# Altium project femtoino.PrjPcb (part 1 of 2)
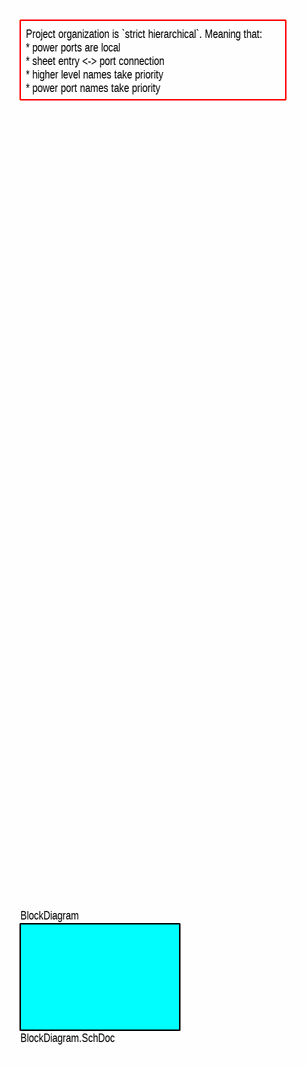
[diagram p0: TitlePage.SchDoc]
GlobalProjectName: femtoino; GlobalRevision: rev.1
11 sheets, 82 parts. Net scope: strictly hierarchical (ports join the sheet entries above them; power ports are local).
Board file: PCB.PcbDoc
Sheets:
  TitlePage.SchDoc
    BlockDiagram = BlockDiagram.SchDoc
      PowerManagement = PowerManagement.SchDoc
        Buck/Boost converter = Buck_boost_converter.SchDoc
        Li-ion charger = Li-ion_charger.SchDoc
      MCU = MCU.SchDoc
      DAC = DAC.SchDoc
      External connectors = External_connectors.SchDoc
        USB = USB.SchDoc
      LED = LED.SchDoc
      Buzzer = Buzzer.SchDoc

## Sheet TitlePage.SchDoc: Title page.
size 297 x 209 mm; Author: Dmitry Shpakov; Organization: NoName; Revision: Revision; SheetNumber: 1; SheetTotal: 9; PageSize: A4; ProjectName: Project Name

### Sub-sheets
BlockDiagram = BlockDiagram.SchDoc: no entries

### Notes on the sheet
- Project organization is `strict hierarchical`. Meaning that:
  * power ports are local
  * sheet entry <-> port connection
  * higher level names take priority
  * power port names take priority
- Author
- Date
- Organization
- Page
- Total pages
- Materials
- Page size

## Sheet BlockDiagram.SchDoc: Block diagram.
size 297 x 209 mm; Author: Dmitry Shpakov; Organization: NoName; Revision: Revision; SheetNumber: 2; SheetTotal: 11; PageSize: A4; ProjectName: Project Name
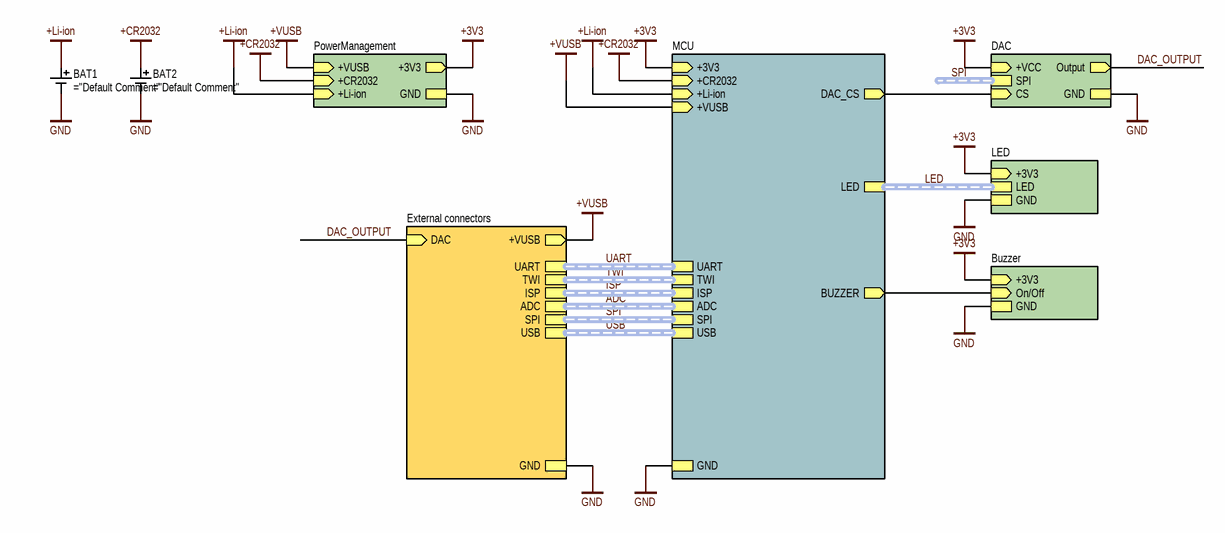
[diagram p1: BlockDiagram.SchDoc]

### Parts
BAT1  (no value)
BAT2  (no value)

### Sub-sheets
Buzzer = Buzzer.SchDoc: +3V3 (in), On/Off (in), GND
DAC = DAC.SchDoc: SPI (harness SPI), GND, CS (in), +VCC (in), Output (out)
External connectors = External_connectors.SchDoc: UART (harness UART), TWI (harness TWI), ISP (harness ISP), ADC (harness ADC), SPI (harness SPI), DAC (in), GND, USB (harness USB), +VUSB (out)
LED = LED.SchDoc: GND, LED (harness LED), +3V3 (in)
MCU = MCU.SchDoc: USB (harness USB), GND, +3V3 (in), SPI (harness SPI), DAC_CS (out), UART (harness UART), TWI (harness TWI), ISP (harness ISP), ADC (harness ADC), LED (harness LED), +VUSB (in), +Li-ion (in), +CR2032 (in), BUZZER (out)
PowerManagement = PowerManagement.SchDoc: +3V3 (out), GND, +VUSB (in), +CR2032 (in), +Li-ion (in)

### Nets
+3V3: sheet PowerManagement/+3V3, sheet MCU/+3V3, sheet DAC/+VCC, sheet LED/+3V3, sheet Buzzer/+3V3
+CR2032: BAT2.POS ; sheet PowerManagement/+CR2032, sheet MCU/+CR2032
+Li-ion: BAT1.POS ; sheet PowerManagement/+Li-ion, sheet MCU/+Li-ion
+VUSB: sheet PowerManagement/+VUSB, sheet MCU/+VUSB, sheet External connectors/+VUSB
GND: BAT1.NEG BAT2.NEG ; sheet PowerManagement/GND, sheet MCU/GND, sheet DAC/GND, sheet External connectors/GND, sheet LED/GND, sheet Buzzer/GND
BUZZER: sheet MCU/BUZZER, sheet Buzzer/On/Off
DAC_CS: sheet MCU/DAC_CS, sheet DAC/CS
DAC_OUTPUT: sheet DAC/Output, sheet External connectors/DAC

### Buses and harness runs
harness ADC = sheet External connectors/ADC = sheet MCU/ADC
harness ISP = sheet External connectors/ISP = sheet MCU/ISP
harness LED = sheet LED/LED = sheet MCU/LED
harness SPI = sheet DAC/SPI
harness SPI = sheet External connectors/SPI = sheet MCU/SPI
harness TWI = sheet External connectors/TWI = sheet MCU/TWI
harness UART = sheet External connectors/UART = sheet MCU/UART
harness USB = sheet External connectors/USB = sheet MCU/USB

### Notes on the sheet
- Author
- Date
- Organization
- Page
- Total pages
- Materials
- Page size

### Library data of the parts
BAT1 = S2B-PH-K-S(LF)(SN): CONN HEADER R/A 2POS 2MM; Manufacturer: JST Sales America Inc.; Default Comment: JST-PH-2; Power Dissipation: * W; Rated Voltage: * V; Rated Current: * A; Tolerance: * %; Other: Connector Header Through Hole, Right Angle 2 position 0.079" (2.00mm); Operating Temperature: -25 °C to +85 °C; Type: connector; HelpURL: https://www.digikey.com/en/products/detail/jst-sales-america-inc/S2B-PH-K-S-LF-SN/926626; Rated Power: * W; Value: *; Summary: ="Type"+" "+"Part Number"+" "+"Manufacturer"+" "+"Value"+" "+"Tolerance"+" "+"Operating Temperature"+" "+"Case"+" "+"Power Dissipation"+" "+"Rated Current"+" "+"Rated Power"+" "+"Rated Voltage"+" "+"Other"; Assembly: *; Case: JST-PH-2; Part Number: S2B-PH-K-S(LF)(SN)
BAT2 = BU2032SM-HD-G: BATT HOLDER COIN 20MM 1 CELL SMD; Manufacturer: MPD (Memory Protection Devices); Default Comment: CR2032; Power Dissipation: * W; Rated Voltage: * V; Rated Current: * A; Tolerance: * %; Other: Battery Holder (Open) Coin, 20.0mm 1 Cell SMD (SMT) Tab; Operating Temperature: -40 °C to +280 °C; Type: connector; HelpURL: https://www.digikey.com/en/products/detail/mpd-memory-protection-devices/BU2032SM-HD-G/755446; Rated Power: * W; Value: *; Summary: ="Type"+" "+"Part Number"+" "+"Manufacturer"+" "+"Value"+" "+"Tolerance"+" "+"Operating Temperature"+" "+"Case"+" "+"Power Dissipation"+" "+"Rated Current"+" "+"Rated Power"+" "+"Rated Voltage"+" "+"Other"; Assembly: *; Case: CR2032; Part Number: BU2032SM-HD-G

## Sheet PowerManagement.SchDoc: Power management.
size 297 x 209 mm; Author: Dmitry Shpakov; Organization: NoName; Revision: Revision; SheetNumber: 3; SheetTotal: 10; PageSize: A4; ProjectName: Project Name
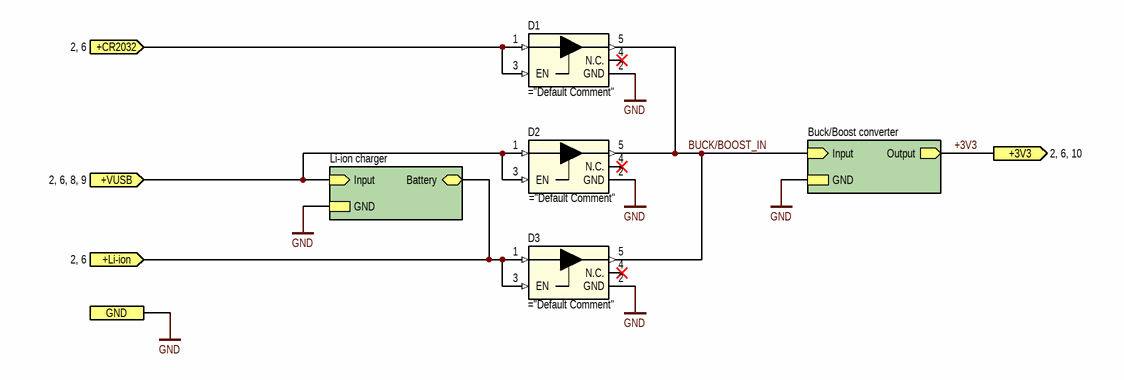
[diagram p2: PowerManagement.SchDoc]

### Parts
D1  (no value)
D2  (no value)
D3  (no value)

### Sub-sheets
Buck/Boost converter = Buck_boost_converter.SchDoc: Input (in), Output (out), GND
Li-ion charger = Li-ion_charger.SchDoc: Input (in), Battery (bidir), GND

### Ports
+3V3 (out, see 2, 6, 10), +CR2032 (in, see 2, 6), +Li-ion (in, see 2, 6), +VUSB (in, see 2, 6, 8, 9), GND (see 2, 4, 5, 6, 7, 8, 9, 10)

### Nets
+3V3: port +3V3, sheet Buck/Boost converter/Output
+CR2032: D1.1(VDD) D1.3(EN) ; port +CR2032
+Li-ion: D3.1(VDD) D3.3(EN) ; port +Li-ion, sheet Li-ion charger/Battery
+VUSB: D2.1(VDD) D2.3(EN) ; port +VUSB, sheet Li-ion charger/Input
GND: D1.2(GND) D2.2(GND) D3.2(GND) ; port GND, sheet Buck/Boost converter/GND, sheet Li-ion charger/GND
BUCK/BOOST_IN: D1.5(OUT) D2.5(OUT) D3.5(OUT) ; sheet Buck/Boost converter/Input

Not connected (* = marked no-connect by the designer): D1 4(N.C.)*; D2 4(N.C.)*; D3 4(N.C.)*

### Notes on the sheet
- Author
- Date
- Organization
- Page
- Total pages
- Materials
- Page size

### Library data of the parts
D1-D3 = MAX40200: IC IDEAL DIODE; Manufacturer: Analog Devices Inc./Maxim Integrated; Default Comment: MAX40203AUK+T; Power Dissipation: * W; Rated Voltage: 1.2 V ~ 5.5 V; Rated Current: 1 A; Tolerance: * %; Other: OR Controller Source Selector Switch P-Channel 1:1 SOT-23-5; Operating Temperature: -40 °C to +125 °C; Type: diode; HelpURL: https://www.digikey.com/en/products/detail/analog-devices-inc-maxim-integrated/MAX40203AUK-T/10447227; Rated Power: * W; Value: *; Summary: ="Type"+" "+"Part Number"+" "+"Manufacturer"+" "+"Value"+" "+"Tolerance"+" "+"Operating Temperature"+" "+"Case"+" "+"Power Dissipation"+" "+"Rated Current"+" "+"Rated Power"+" "+"Rated Voltage"+" "+"Other"; Assembly: *; Case: SOT-23-5; Part Number: MAX40203AUK+T

## Sheet Buck_boost_converter.SchDoc: +3V3 buck/boost converter.
size 297 x 209 mm; Author: Dmitry Shpakov; Organization: NoName; Revision: Revision; SheetNumber: 4; SheetTotal: 5; PageSize: A4; ProjectName: Project Name
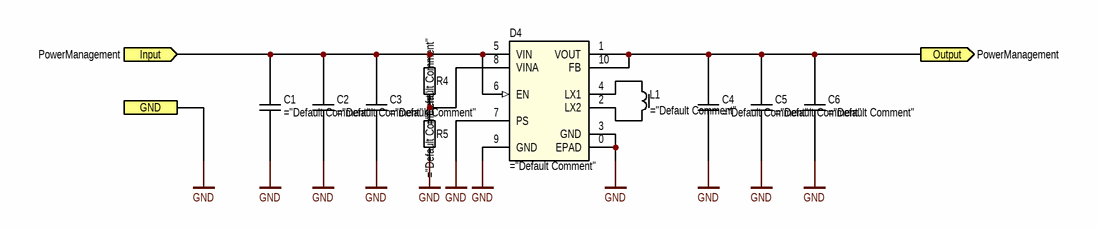
[diagram p3: Buck_boost_converter.SchDoc]

### Parts
C1  (no value)
C2  (no value)
C3  (no value)
C4  (no value)
C5  (no value)
C6  (no value)
D4  (no value)
L1  (no value)
R4  (no value)
R5  (no value)

### Ports
GND (see PowerManagement, Li-ion_charger, PowerManagement), Input (in, see PowerManagement), Output (out, see PowerManagement)

### Nets
+3V3: C4.1 C5.1 C6.2 D4.1(VOUT) D4.10(FB) ; port Output
GND: C1.1 C2.2 C3.2 C4.2 C5.2 C6.1 D4.0(EPAD) D4.3(GND) D4.7(PS) D4.9(GND) R5.1 ; port GND
BUCK/BOOST_IN: C1.2 C2.1 C3.1 D4.5(VIN) D4.6(EN) R4.2 ; port Input
NetD4_2: D4.2(LX2) L1.2
NetD4_4: D4.4(LX1) L1.1
NetD4_8: D4.8(VINA) R4.1 R5.2

### Notes on the sheet
- Author
- Date
- Organization
- Page
- Total pages
- Materials
- Page size

### Library data of the parts
C1 C6 = CC0805KKX5R6BB105: CAP CER 1UF 10V X5R 0805; Manufacturer: YAGEO; Type: capacitor; Power Dissipation: * W; Rated Current: * A; Tolerance: 10 %; Other: 1 µF ±10% 10V Ceramic Capacitor X5R 0805 (2012 Metric); Operating Temperature: -55 °C to +85 °C; HelpURL: https://www.digikey.com/en/products/detail/yageo/CC0805KKX5R6BB105/2345239; Default Comment: 1 uF; Rated Voltage: 10 V; Rated Power: * W; Value: 1 uF; Summary: ="Type"+" "+"Part Number"+" "+"Manufacturer"+" "+"Value"+" "+"Tolerance"+" "+"Operating Temperature"+" "+"Case"+" "+"Power Dissipation"+" "+"Rated Current"+" "+"Rated Power"+" "+"Rated Voltage"+" "+"Other"; Assembly: *; Case: 0805; Part Number: CC0805KKX5R6BB105
C2-C5 = CC0805KPX5R6BB106: CAP CER 10UF 10V X5R 0805; Manufacturer: YAGEO; Type: capacitor; Power Dissipation: * W; Rated Current: * A; Tolerance: 10 %; Other: 10 µF ±10% 10V Ceramic Capacitor X5R 0805 (2012 Metric); Operating Temperature: -55 °C to +85 °C; HelpURL: https://www.digikey.com/en/products/detail/yageo/CC0805KPX5R6BB106/11611309; Default Comment: 10 uF; Rated Voltage: 10 V; Rated Power: * W; Value: 10 uF; Summary: ="Type"+" "+"Part Number"+" "+"Manufacturer"+" "+"Value"+" "+"Tolerance"+" "+"Operating Temperature"+" "+"Case"+" "+"Power Dissipation"+" "+"Rated Current"+" "+"Rated Power"+" "+"Rated Voltage"+" "+"Other"; Assembly: *; Case: 0805; Part Number: CC0805KPX5R6BB106
D4 = RT6150B-33GQW: IC REG BCK BST 3.3V 800MA 10WDFN; Manufacturer: Richtek USA Inc.; Power Dissipation: * W; Tolerance: * %; Other: Buck-Boost Switching Regulator IC Positive Fixed 3.3V 1 Output 800mA 10-WFDFN Exposed Pad; Operating Temperature: -40 °C to +85 °C; Type: ic; HelpURL: https://www.digikey.com/en/products/detail/richtek-usa-inc/RT6150B-33GQW/6676709; Default Comment: RT6150B-33GQW; Rated Voltage: 3.3 V; Rated Current: 800 mA; Rated Power: * W; Value: *; Summary: ="Type"+" "+"Part Number"+" "+"Manufacturer"+" "+"Value"+" "+"Tolerance"+" "+"Operating Temperature"+" "+"Case"+" "+"Power Dissipation"+" "+"Rated Current"+" "+"Rated Power"+" "+"Rated Voltage"+" "+"Other"; Assembly: *; Case: 10-WDFN (2.5x2.5); Part Number: RT6150B-33GQW
L1 = 74479887222C: FIXED IND 2.2UH 1.6A 110MOHM SMD; Manufacturer: Würth Elektronik; Type: inductor; Power Dissipation: * W; Rated Voltage: * V; Tolerance: * %; Other: 2.2 µH Shielded Multilayer Inductor 1.6 A 110mOhm 1008 (2520 Metric); Operating Temperature: -40 °C to +125 °C; HelpURL: https://www.digikey.com/en/products/detail/w%C3%BCrth-elektronik/74479887222C/5870496; Default Comment: 2.2 uH; Rated Current: 1.6 A; Rated Power: * W; Value: 2.2 uH; Summary: ="Type"+" "+"Part Number"+" "+"Manufacturer"+" "+"Value"+" "+"Tolerance"+" "+"Operating Temperature"+" "+"Case"+" "+"Power Dissipation"+" "+"Rated Current"+" "+"Rated Power"+" "+"Rated Voltage"+" "+"Other"; Assembly: *; Case: 1008; Part Number: 74479887222C
R4 = RC0603FR-0756KL: RES 56K OHM 1% 1/10W 0603; Manufacturer: YAGEO; Rated Voltage: * V; Rated Current: * A; Other: 56 kOhms ±1% 0.1W, 1/10W Chip Resistor 0603 (1608 Metric) Moisture Resistant Thick Film; Operating Temperature: -55 °C to +155 °C; Type: resistor; HelpURL: https://www.digikey.com/en/products/detail/yageo/RC0603FR-0756KL/2827626; Default Comment: 56k; Power Dissipation: 1/10 W; Rated Power: 1/10 W; Tolerance: 1 %; Value: 56k; Summary: ="Type"+" "+"Part Number"+" "+"Manufacturer"+" "+"Value"+" "+"Tolerance"+" "+"Operating Temperature"+" "+"Case"+" "+"Power Dissipation"+" "+"Rated Current"+" "+"Rated Power"+" "+"Rated Voltage"+" "+"Other"; Assembly: *; Case: 0603; Part Number: RC0603FR-0756KL
R5 = RC0603FR-0786K6L: RES 86.6K OHM 1% 1/10W 0603; Manufacturer: YAGEO; Default Comment: 86k6; Rated Voltage: * V; Rated Current: * A; Value: 86k6; Other: 86.6 kOhms ±1% 0.1W, 1/10W Chip Resistor 0603 (1608 Metric) Moisture Resistant Thick Film; Operating Temperature: -55 °C to +155 °C; Type: resistor; HelpURL: https://www.digikey.com/en/products/detail/yageo/RC0603FR-0786K6L/727411?s=N4IgjCBcoMxaBjKAzAhgGwM4FMA0IB7KAbXDBggF18AHAFyhAGU6AnASwDsBzEAX3xgAbPBBJIaLHkIkQMAJwAmACwjqIeoxYce-fIoAMADgCso8ZJz4ikUkaEA6IQAIA1gHkAFgFtMIdZqQIACqnOx07sgAstiomACurNh6IAC0ENBiKBhWMrbgcJQCaYrmUGzx0jakZkXFIpnsACaM6QaltAxBIPh0AJ40yUFNmEh8fEA; Power Dissipation: 1/10 W; Rated Power: 1/10 W; Tolerance: 1 %; Summary: ="Type"+" "+"Part Number"+" "+"Manufacturer"+" "+"Value"+" "+"Tolerance"+" "+"Operating Temperature"+" "+"Case"+" "+"Power Dissipation"+" "+"Rated Current"+" "+"Rated Power"+" "+"Rated Voltage"+" "+"Other"; Assembly: *; Case: 0603; Part Number: RC0603FR-0786K6L

## Sheet Li-ion_charger.SchDoc: Li-ion battery charger.
size 297 x 209 mm; Author: Dmitry Shpakov; Organization: NoName; Revision: Revision; SheetNumber: 5; SheetTotal: 5; PageSize: A4; ProjectName: Project Name
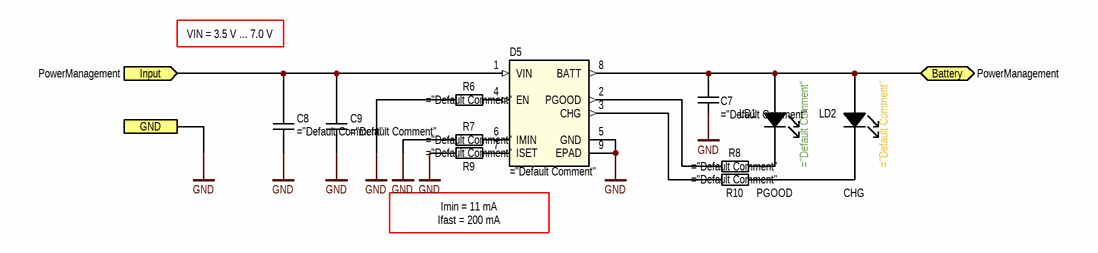
[diagram p4: Li-ion_charger.SchDoc]

### Parts
C7  (no value)
C8  (no value)
C9  (no value)
D5  (no value)
LD1  (no value)
LD2  (no value)
R6  (no value)
R7  (no value)
R8  (no value)
R9  (no value)
R10  (no value)

### Ports
Battery (bidir, see PowerManagement), GND (see PowerManagement, Buck_boost_converter, PowerManagement), Input (in, see PowerManagement)

### Nets
+Li-ion: C7.2 D5.8(BATT) LD1.C LD2.C ; port Battery
+VUSB: C8.1 C9.2 D5.1(VIN) ; port Input
GND: C7.1 C8.2 C9.1 D5.5(GND) D5.9(EPAD) R6.1 R7.2 R9.1 ; port GND
NetD5_2: D5.2(PGOOD) R8.1
NetD5_3: D5.3(CHG) R10.1
NetD5_4: D5.4(EN) R6.2
NetD5_6: D5.6(IMIN) R7.1
NetD5_7: D5.7(ISET) R9.2
NetLD1_A: LD1.A R8.2
NetLD2_A: LD2.A R10.2

### Notes on the sheet
- VIN = 3.5 V ... 7.0 V
- Imin = 11 mA
  Ifast = 200 mA
- PGOOD
- CHG
- Author
- Date
- Organization
- Page
- Total pages
- Materials
- Page size

### Library data of the parts
C7 C9 = CC0805KKX5R6BB105: as C1 on sheet Buck_boost_converter; Operating Temperature: -55 °C to +85 °C; HelpURL: https://www.digikey.com/en/products/detail/yageo/CC0805KKX5R6BB105/2345239; Default Comment: 1 uF; Rated Voltage: 10 V; Rated Power: * W; Value: 1 uF; Summary: ="Type"+" "+"Part Number"+" "+"Manufacturer"+" "+"Value"+" "+"Tolerance"+" "+"Operating Temperature"+" "+"Case"+" "+"Power Dissipation"+" "+"Rated Current"+" "+"Rated Power"+" "+"Rated Voltage"+" "+"Other"; Assembly: *; Case: 0805; Part Number: CC0805KKX5R6BB105
C8 = CC0805KPX5R6BB106: as C2 on sheet Buck_boost_converter; Operating Temperature: -55 °C to +85 °C; HelpURL: https://www.digikey.com/en/products/detail/yageo/CC0805KPX5R6BB106/11611309; Default Comment: 10 uF; Rated Voltage: 10 V; Rated Power: * W; Value: 10 uF; Summary: ="Type"+" "+"Part Number"+" "+"Manufacturer"+" "+"Value"+" "+"Tolerance"+" "+"Operating Temperature"+" "+"Case"+" "+"Power Dissipation"+" "+"Rated Current"+" "+"Rated Power"+" "+"Rated Voltage"+" "+"Other"; Assembly: *; Case: 0805; Part Number: CC0805KPX5R6BB106
D5 = RT9526AGQW: IC LI-ION BATT CHGR WDFN-8; Manufacturer: Richtek USA Inc.; Power Dissipation: * W; Rated Voltage: 28 V; Rated Current: * A; Tolerance: * %; Other: Charger IC Lithium Ion 8-WDFN (2x3); Operating Temperature: -40 °C to +85 °C; Type: ic; HelpURL: https://www.digikey.com/en/products/detail/richtek-usa-inc/RT9526AGQW/16376728; Default Comment: RT9526AGQW; Rated Power: * W; Value: *; Summary: ="Type"+" "+"Part Number"+" "+"Manufacturer"+" "+"Value"+" "+"Tolerance"+" "+"Operating Temperature"+" "+"Case"+" "+"Power Dissipation"+" "+"Rated Current"+" "+"Rated Power"+" "+"Rated Voltage"+" "+"Other"; Assembly: *; Case: 8-WDFN (2x3); Part Number: RT9526AGQW
LD1 = LTST-C191KGKT: LED GREEN CLEAR SMD; Manufacturer: Lite-On Inc.; Power Dissipation: * W; Tolerance: * %; Other: Green 571nm LED Indication - Discrete 2V 0603 (1608 Metric); Rated Voltage: 2 V; Rated Current: 20 mA; Operating Temperature: -55 °C to +85 °C; Type: led; HelpURL: https://www.digikey.com/en/products/detail/liteon/LTST-C191KGKT/386835; Default Comment: green; Rated Power: * W; Summary: ="Type"+" "+"Part Number"+" "+"Manufacturer"+" "+"Value"+" "+"Tolerance"+" "+"Operating Temperature"+" "+"Case"+" "+"Power Dissipation"+" "+"Rated Current"+" "+"Rated Power"+" "+"Rated Voltage"+" "+"Other"; Assembly: *; Case: 0603; Part Number: LTST-C191KGKT; Value: green
LD2 = LTST-C191KSKT: LED YELLOW CLEAR SMD; Manufacturer: Lite-On Inc.; Power Dissipation: * W; Tolerance: * %; Other: Yellow 591nm LED Indication - Discrete 2.1V 0603 (1608 Metric); Rated Voltage: 2.1 V; Rated Current: 20 mA; Operating Temperature: -55 °C to +85 °C; Type: led; HelpURL: https://www.digikey.com/en/products/detail/liteon/LTST-C191KSKT/386839; Default Comment: yellow; Rated Power: * W; Summary: ="Type"+" "+"Part Number"+" "+"Manufacturer"+" "+"Value"+" "+"Tolerance"+" "+"Operating Temperature"+" "+"Case"+" "+"Power Dissipation"+" "+"Rated Current"+" "+"Rated Power"+" "+"Rated Voltage"+" "+"Other"; Assembly: *; Case: 0603; Part Number: LTST-C191KSKT; Value: yellow
R6 = RC0603FR-07200KL: RES 200K OHM 1% 1/10W 0603; Manufacturer: YAGEO; Power Dissipation: 0.1 W; Rated Voltage: * V; Rated Current: * A; Other: 200 kOhms ±1% 0.1W, 1/10W Chip Resistor 0603 (1608 Metric) Moisture Resistant Thick Film; Operating Temperature: -55 °C to +155 °C; Type: resistor; HelpURL: https://www.digikey.com/en/products/detail/yageo/RC0603FR-07200KL/727044; Default Comment: 200k; Rated Power: 0.1 W; Tolerance: 1 %; Value: 200k; Summary: ="Type"+" "+"Part Number"+" "+"Manufacturer"+" "+"Value"+" "+"Tolerance"+" "+"Operating Temperature"+" "+"Case"+" "+"Power Dissipation"+" "+"Rated Current"+" "+"Rated Power"+" "+"Rated Voltage"+" "+"Other"; Assembly: *; Case: 0603; Part Number: RC0603FR-07200KL
R7 = RC0603FR-071ML: RES 1M OHM 1% 1/10W 0603; Manufacturer: YAGEO; Power Dissipation: 0.1 W; Rated Voltage: * V; Rated Current: * A; Other: 1 MOhms ±1% 0.1W, 1/10W Chip Resistor 0603 (1608 Metric) Moisture Resistant Thick Film; Operating Temperature: -55 °C to +155 °C; Type: resistor; HelpURL: https://www.digikey.com/en/products/detail/yageo/RC0603FR-071ML/726844; Default Comment: 1M; Rated Power: 0.1 W; Tolerance: 1 %; Value: 1M; Summary: ="Type"+" "+"Part Number"+" "+"Manufacturer"+" "+"Value"+" "+"Tolerance"+" "+"Operating Temperature"+" "+"Case"+" "+"Power Dissipation"+" "+"Rated Current"+" "+"Rated Power"+" "+"Rated Voltage"+" "+"Other"; Assembly: *; Case: 0603; Part Number: RC0603FR-071ML
R8 R10 = RC0603FR-07270RL: RES 270 OHM 1% 1/10W 0603; Manufacturer: YAGEO; Default Comment: 270R; Power Dissipation: 0.1 W; Rated Voltage: * V; Rated Current: * A; Value: 270R; Other: 270 Ohms ±1% 0.1W, 1/10W Chip Resistor 0603 (1608 Metric) Moisture Resistant Thick Film; Operating Temperature: -55 °C to +155 °C; Type: resistor; HelpURL: https://www.digikey.com/en/products/detail/yageo/RC0603FR-07270RL/727103; Rated Power: 0.1 W; Tolerance: 1 %; Summary: ="Type"+" "+"Part Number"+" "+"Manufacturer"+" "+"Value"+" "+"Tolerance"+" "+"Operating Temperature"+" "+"Case"+" "+"Power Dissipation"+" "+"Rated Current"+" "+"Rated Power"+" "+"Rated Voltage"+" "+"Other"; Assembly: *; Case: 0603; Part Number: RC0603FR-07270RL
R9 = RC0603FR-0762KL: RES 62K OHM 1% 1/10W 0603; Manufacturer: YAGEO; Power Dissipation: 0.1 W; Rated Voltage: * V; Rated Current: * A; Other: 62 kOhms ±1% 0.1W, 1/10W Chip Resistor 0603 (1608 Metric) Moisture Resistant Thick Film; Operating Temperature: -55 °C to +155 °C; Type: resistor; HelpURL: https://www.digikey.com/en/products/detail/yageo/RC0603FR-0762KL/727336; Default Comment: 62k; Rated Power: 0.1 W; Tolerance: 1 %; Value: 62k; Summary: ="Type"+" "+"Part Number"+" "+"Manufacturer"+" "+"Value"+" "+"Tolerance"+" "+"Operating Temperature"+" "+"Case"+" "+"Power Dissipation"+" "+"Rated Current"+" "+"Rated Power"+" "+"Rated Voltage"+" "+"Other"; Assembly: *; Case: 0603; Part Number: RC0603FR-0762KL

## Sheet MCU.SchDoc: MCU
size 297 x 209 mm; Author: Dmitry Shpakov; Organization: NoName; Revision: Revision; SheetNumber: 6; SheetTotal: 10; PageSize: A4; ProjectName: Project Name
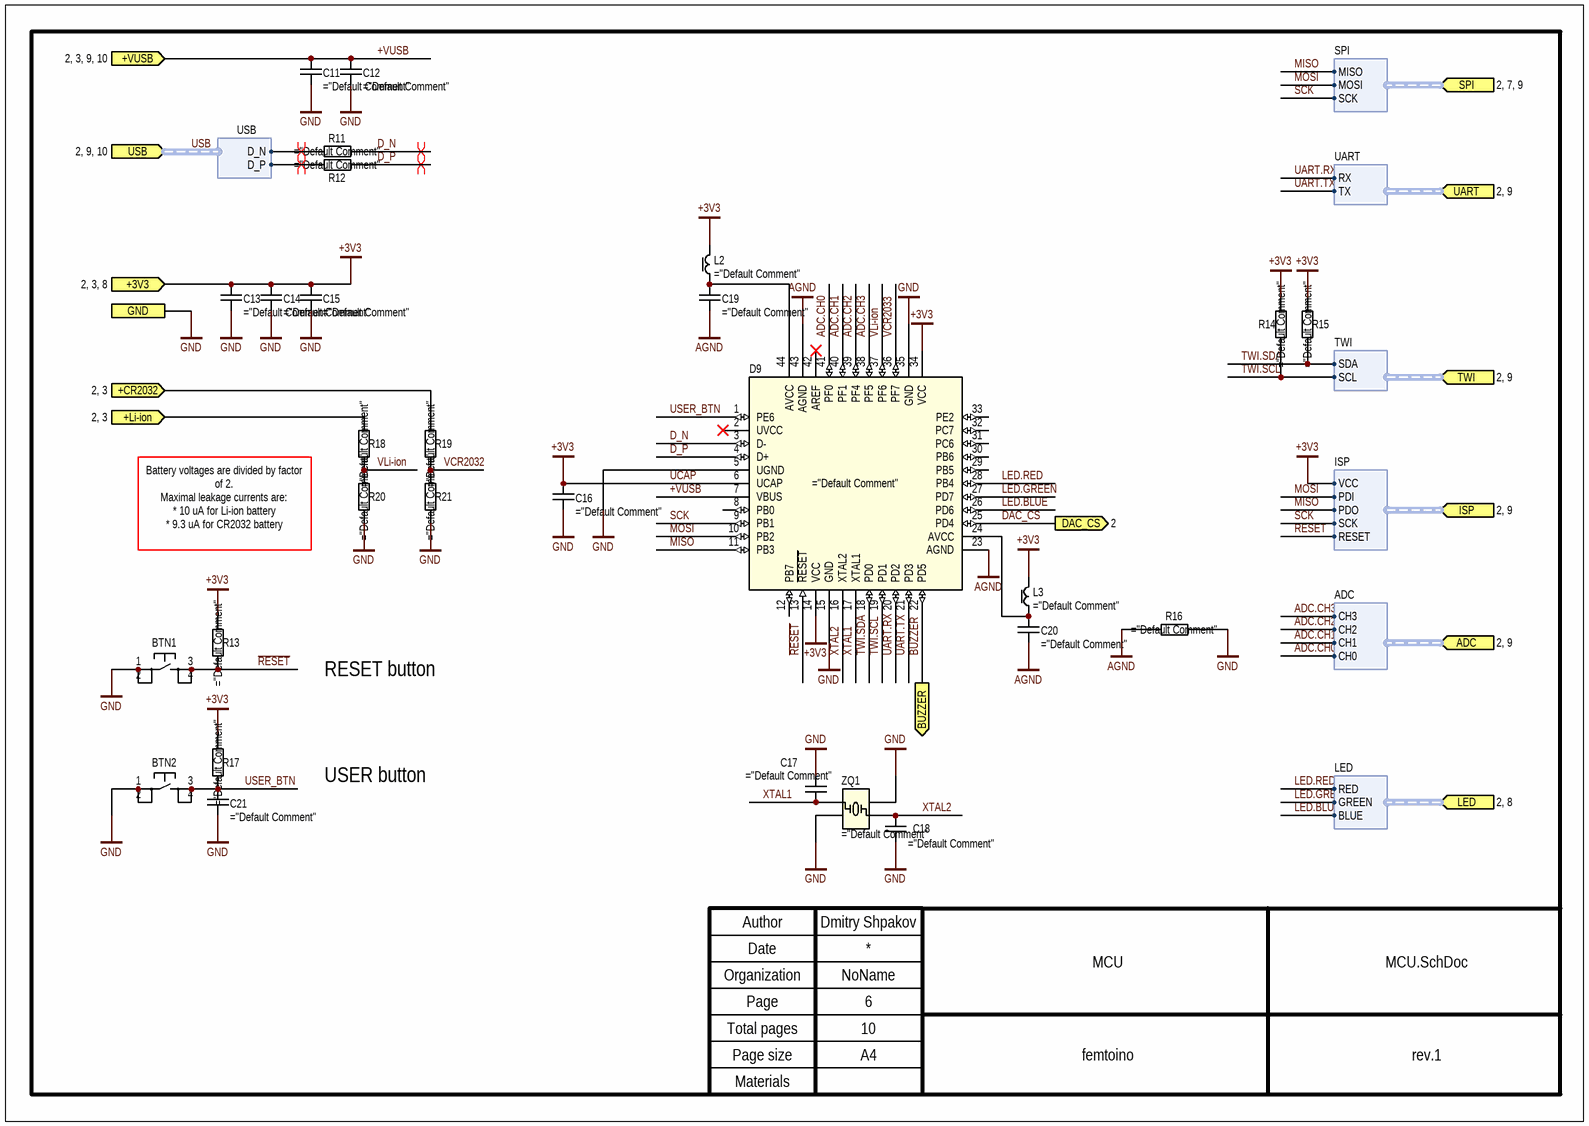
[diagram p5: MCU.SchDoc]

### Parts
BTN1  (no value)
BTN2  (no value)
C11  (no value)
C12  (no value)
C13  (no value)
C14  (no value)
C15  (no value)
C16  (no value)
C17  (no value)
C18  (no value)
C19  (no value)
C20  (no value)
C21  (no value)
D9  (no value)
L2  (no value)
L3  (no value)
R11  (no value)
R12  (no value)
R13  (no value)
R14  (no value)
R15  (no value)
R16  (no value)
R17  (no value)
R18  (no value)
R19  (no value)
R20  (no value)
R21  (no value)
ZQ1  (no value)

### Ports
+3V3 (in, see 2, 3, 8), +CR2032 (in, see 2, 3), +Li-ion (in, see 2, 3), +VUSB (in, see 2, 3, 9, 10), ADC (in, harness ADC, see 2, 9), BUZZER (out), DAC_CS (out, see 2), GND (see 2, 3, 4, 5, 7, 8, 9, 10), ISP (in, harness ISP, see 2, 9), LED (in, harness LED, see 2, 8), SPI (in, harness SPI, see 2, 7, 9), TWI (in, harness TWI, see 2, 9), UART (in, harness UART, see 2, 9), USB (in, harness USB, see 2, 9, 10)

### Harnesses
USB: D_N, D_P
SPI: MISO, MOSI, SCK
UART: RX, TX
TWI: SDA, SCL
ISP: VCC, PDI, PDO, SCK, RESET
ADC: CH3, CH2, CH1, CH0
LED: RED, GREEN, BLUE

### Nets
+3V3: C13.2 C14.2 C15.2 C16.2 D9.6(UCAP) D9.14(VCC) D9.34(VCC) L2.2 L3.2 R13.2 R14.2 R15.2 R17.2 ; port +3V3, port ISP.VCC  [also labelled UCAP]
+CR2032: R19.2 ; port +CR2032
+Li-ion: R18.2 ; port +Li-ion
+VUSB: C11.2 C12.2 D9.7(VBUS) ; port +VUSB
AGND: C19.1 C20.1 D9.23(AGND) D9.43(AGND) R16.1
GND: BTN1.1 BTN1.2 BTN2.1 BTN2.2 C11.1 C12.1 C13.1 C14.1 C15.1 C16.1 C17.1 C18.1 C21.1 D9.5(UGND) D9.15(GND) D9.35(GND) R16.2 R20.1 R21.1 ZQ1.2 ZQ1.4 ; port GND
ADC.CH0: D9.41(PF0) ; port ADC.CH0
ADC.CH1: D9.40(PF1) ; port ADC.CH1
ADC.CH2: D9.39(PF4) ; port ADC.CH2
ADC.CH3: D9.38(PF5) ; port ADC.CH3
BUZZER: D9.22(PD5) ; port BUZZER
D_N: D9.3(D-) R11.2
D_P: D9.4(D+) R12.2
DAC_CS: D9.25(PD4) ; port DAC_CS
LED.BLUE: D9.26(PD6) ; port LED.BLUE
LED.GREEN: D9.27(PD7) ; port LED.GREEN
LED.RED: D9.28(PB4) ; port LED.RED
MISO: D9.11(PB3) ; port SPI.MISO, port ISP.PDO  [project net ISP.PDO]
MOSI: D9.10(PB2) ; port SPI.MOSI, port ISP.PDI  [project net ISP.PDI]
~{RESET}: BTN1.3 BTN1.4 D9.13(~{RESET}) R13.1 ; port ISP.RESET  [project net ISP.RESET]
SCK: D9.9(PB1) ; port SPI.SCK, port ISP.SCK  [project net ISP.SCK]
TWI.SCL: D9.19(PD1) R14.1 ; port TWI.SCL
TWI.SDA: D9.18(PD0) R15.1 ; port TWI.SDA
UART.RX: D9.20(PD2) ; port UART.RX
UART.TX: D9.21(PD3) ; port UART.TX
USB.D_N: R11.1 ; port USB.D_N
USB.D_P: R12.1 ; port USB.D_P
USER_BTN: BTN2.3 BTN2.4 C21.2 D9.1(PE6) R17.1
VCR2032: R19.1 R21.2
VCR2033: D9.36(PF7)
VLi-ion: D9.37(PF6) R18.1 R20.2
XTAL1: C17.2 D9.17(XTAL1) ZQ1.1
XTAL2: C18.2 D9.16(XTAL2) ZQ1.3
NetC19_2: C19.2 D9.44(AVCC) L2.1
NetC20_2: C20.2 D9.24(AVCC) L3.1

Not connected (* = marked no-connect by the designer): D9 2(UVCC)* 8(PB0) 12(PB7) 29(PB5) 30(PB6) 31(PC6) 32(PC7) 33(PE2) 42(AREF)*

### Buses and harness runs
harness USB = port USB

### Layout directives
differential pair: D_N, D_P, USB.D_N, USB.D_P

### Notes on the sheet
- Battery voltages are divided by factor of 2.
  Maximal leakage currents are:
  * 10 uA for Li-ion battery
  * 9.3 uA for CR2032 battery
- RESET button
- USER button
- Author
- Date
- Organization
- Page
- Total pages
- Materials
- Page size

### Library data of the parts
BTN1 BTN2 = PTS810 SJK 250 SMTR LFS: SWITCH TACTILE SPST-NO 0.05A 16V; Manufacturer: C&K; Power Dissipation: * W; Rated Voltage: * V; Rated Current: * A; Tolerance: * %; Other: Tactile Switch SPST-NO Top Actuated Surface Mount; Operating Temperature: -40 °C to +85 °C; Type: button; HelpURL: https://www.digikey.com/en/products/detail/c-k/PTS810-SJK-250-SMTR-LFS/4176611; Default Comment: PTS810 SJK 250 SMTR LFS; Rated Power: * W; Value: *; Summary: ="Type"+" "+"Part Number"+" "+"Manufacturer"+" "+"Value"+" "+"Tolerance"+" "+"Operating Temperature"+" "+"Case"+" "+"Power Dissipation"+" "+"Rated Current"+" "+"Rated Power"+" "+"Rated Voltage"+" "+"Other"; Assembly: *; Case: 4.20mm x 3.20mm; Part Number: PTS810 SJK 250 SMTR LFS
C11 C13 C14 = CC0805KPX5R6BB106: as C2 on sheet Buck_boost_converter; Operating Temperature: -55 °C to +85 °C; HelpURL: https://www.digikey.com/en/products/detail/yageo/CC0805KPX5R6BB106/11611309; Default Comment: 10 uF; Rated Voltage: 10 V; Rated Power: * W; Value: 10 uF; Summary: ="Type"+" "+"Part Number"+" "+"Manufacturer"+" "+"Value"+" "+"Tolerance"+" "+"Operating Temperature"+" "+"Case"+" "+"Power Dissipation"+" "+"Rated Current"+" "+"Rated Power"+" "+"Rated Voltage"+" "+"Other"; Assembly: *; Case: 0805; Part Number: CC0805KPX5R6BB106
C12 C15 C16 = CC0805KKX5R6BB105: as C1 on sheet Buck_boost_converter; Operating Temperature: -55 °C to +85 °C; HelpURL: https://www.digikey.com/en/products/detail/yageo/CC0805KKX5R6BB105/2345239; Default Comment: 1 uF; Rated Voltage: 10 V; Rated Power: * W; Value: 1 uF; Summary: ="Type"+" "+"Part Number"+" "+"Manufacturer"+" "+"Value"+" "+"Tolerance"+" "+"Operating Temperature"+" "+"Case"+" "+"Power Dissipation"+" "+"Rated Current"+" "+"Rated Power"+" "+"Rated Voltage"+" "+"Other"; Assembly: *; Case: 0805; Part Number: CC0805KKX5R6BB105
C17 C18 = CC0603JRNPO9BN120: CAP CER 12PF 50V C0G/NPO 0603; Manufacturer: YAGEO; Type: capacitor; Power Dissipation: * W; Rated Current: * A; Tolerance: 5 %; Other: 12 pF ±5% 50V Ceramic Capacitor C0G, NP0 0603 (1608 Metric); Operating Temperature: -55 °C to +125 °C; HelpURL: https://www.digikey.com/en/products/detail/yageo/CC0603JRNPO9BN120/302793; Default Comment: 12 pF; Rated Power: * W; Value: 12 pF; Summary: ="Type"+" "+"Part Number"+" "+"Manufacturer"+" "+"Value"+" "+"Tolerance"+" "+"Operating Temperature"+" "+"Case"+" "+"Power Dissipation"+" "+"Rated Current"+" "+"Rated Power"+" "+"Rated Voltage"+" "+"Other"; Assembly: *; Case: 0603; Part Number: CC0603JRNPO9BN120; Rated Voltage: 50 V
C19-C21 = CC0805KRX7R9BB104: CAP CER 0.1UF 50V X7R 0805; Manufacturer: YAGEO; Type: capacitor; Power Dissipation: * W; Rated Current: * A; Tolerance: 10 %; Other: 0.1 µF ±10% 50V Ceramic Capacitor X7R 0805 (2012 Metric); Operating Temperature: -55 °C to +125 °C; HelpURL: https://www.digikey.com/en/products/detail/yageo/CC0805KRX7R9BB104/302874; Default Comment: 0.1 uF; Rated Voltage: 50 V; Rated Power: * W; Value: 0.1 uF; Summary: ="Type"+" "+"Part Number"+" "+"Manufacturer"+" "+"Value"+" "+"Tolerance"+" "+"Operating Temperature"+" "+"Case"+" "+"Power Dissipation"+" "+"Rated Current"+" "+"Rated Power"+" "+"Rated Voltage"+" "+"Other"; Assembly: *; Case: 0805; Part Number: CC0805KRX7R9BB104
D9 = ATMEGA32U4-MU: IC MCU 8BIT 32KB FLASH 44VQFN; Manufacturer: Microchip Technology; Power Dissipation: * W; Rated Voltage: 2.7V ~ 5.5 V; Rated Current: * A; Tolerance: * %; Other: AVR AVR® ATmega Microcontroller IC 8-Bit 16MHz 32KB (16K x 16) FLASH 44-VQFN (7x7); Operating Temperature: -40 °C to +85 °C; Type: ic; HelpURL: https://www.digikey.com/en/products/detail/microchip-technology/ATMEGA32U4-MU/1914603; Default Comment: ATMEGA32U4-MU; Rated Power: * W; Value: *; Summary: ="Type"+" "+"Part Number"+" "+"Manufacturer"+" "+"Value"+" "+"Tolerance"+" "+"Operating Temperature"+" "+"Case"+" "+"Power Dissipation"+" "+"Rated Current"+" "+"Rated Power"+" "+"Rated Voltage"+" "+"Other"; Assembly: *; Case: 44-VQFN (7x7); Part Number: ATMEGA32U4-MU
L2 L3 = 74479887310A: FIXED IND 10UH 850MA 300MOHM SMD; Manufacturer: Würth Elektronik; Type: inductor; Power Dissipation: * W; Rated Voltage: * V; Tolerance: * %; Other: 10 µH Shielded Multilayer Inductor 850 mA 300mOhm 1008 (2520 Metric); Operating Temperature: -40 °C to +125 °C; HelpURL: https://www.digikey.com/en/products/detail/w%C3%BCrth-elektronik/74479887310A/4120129; Default Comment: 10 uH; Rated Current: 850 mA; Rated Power: * W; Value: 10 uH; Summary: ="Type"+" "+"Part Number"+" "+"Manufacturer"+" "+"Value"+" "+"Tolerance"+" "+"Operating Temperature"+" "+"Case"+" "+"Power Dissipation"+" "+"Rated Current"+" "+"Rated Power"+" "+"Rated Voltage"+" "+"Other"; Assembly: *; Case: 1008; Part Number: 74479887310A
R11 R12 = RC0603FR-0722RL: RES 22 OHM 1% 1/10W 0603; Manufacturer: YAGEO; Default Comment: 22R; Rated Voltage: * V; Rated Current: * A; Value: 22R; Other: 22 Ohms ±1% 0.1W, 1/10W Chip Resistor 0603 (1608 Metric) Moisture Resistant Thick Film; Operating Temperature: -55 °C to +155 °C; Type: resistor; HelpURL: https://www.digikey.com/en/products/detail/yageo/RC0603FR-0722RL/727055; Power Dissipation: 1/10 W; Rated Power: 1/10 W; Tolerance: 1 %; Summary: ="Type"+" "+"Part Number"+" "+"Manufacturer"+" "+"Value"+" "+"Tolerance"+" "+"Operating Temperature"+" "+"Case"+" "+"Power Dissipation"+" "+"Rated Current"+" "+"Rated Power"+" "+"Rated Voltage"+" "+"Other"; Assembly: *; Case: 0603; Part Number: RC0603FR-0722RL
R13 R17 = RC0603FR-0762KL: as R9 on sheet Li-ion_charger; Operating Temperature: -55 °C to +155 °C; Type: resistor; HelpURL: https://www.digikey.com/en/products/detail/yageo/RC0603FR-0762KL/727336; Default Comment: 62k; Rated Power: 0.1 W; Tolerance: 1 %; Value: 62k; Summary: ="Type"+" "+"Part Number"+" "+"Manufacturer"+" "+"Value"+" "+"Tolerance"+" "+"Operating Temperature"+" "+"Case"+" "+"Power Dissipation"+" "+"Rated Current"+" "+"Rated Power"+" "+"Rated Voltage"+" "+"Other"; Assembly: *; Case: 0603; Part Number: RC0603FR-0762KL
R14 R15 = RC0603FR-075K1L: RES 5.1K OHM 1% 1/10W 0603; Manufacturer: YAGEO; Default Comment: 5k1; Rated Voltage: * V; Rated Current: * A; Value: 5k1; Other: 5.1 kOhms ±1% 0.1W, 1/10W Chip Resistor 0603 (1608 Metric) Moisture Resistant Thick Film; Operating Temperature: -55 °C to +155 °C; Type: resistor; HelpURL: https://www.digikey.com/en/products/detail/yageo/RC0603FR-075K1L/727268; Power Dissipation: 1/10 W; Rated Power: 1/10 W; Tolerance: 1 %; Summary: ="Type"+" "+"Part Number"+" "+"Manufacturer"+" "+"Value"+" "+"Tolerance"+" "+"Operating Temperature"+" "+"Case"+" "+"Power Dissipation"+" "+"Rated Current"+" "+"Rated Power"+" "+"Rated Voltage"+" "+"Other"; Assembly: *; Case: 0603; Part Number: RC0603FR-075K1L
R16 = RC0603JR-070RL: RES 0 OHM JUMPER 1/10W 0603; Manufacturer: YAGEO; Default Comment: 0R; Power Dissipation: * W; Rated Voltage: * V; Rated Current: * A; Tolerance: * %; Value: 0R; Other: 0 Ohms Jumper Chip Resistor 0603 (1608 Metric) Moisture Resistant Thick Film; Operating Temperature: -55 °C to +155 °C; Type: resistor; HelpURL: https://www.digikey.com/en/products/detail/yageo/RC0603JR-070RL/726675; Rated Power: * W; Summary: ="Type"+" "+"Part Number"+" "+"Manufacturer"+" "+"Value"+" "+"Tolerance"+" "+"Operating Temperature"+" "+"Case"+" "+"Power Dissipation"+" "+"Rated Current"+" "+"Rated Power"+" "+"Rated Voltage"+" "+"Other"; Assembly: *; Case: 0603; Part Number: RC0603JR-070RL
R18-R21 = RC0603FR-07200KL: as R6 on sheet Li-ion_charger; Operating Temperature: -55 °C to +155 °C; Type: resistor; HelpURL: https://www.digikey.com/en/products/detail/yageo/RC0603FR-07200KL/727044; Default Comment: 200k; Rated Power: 0.1 W; Tolerance: 1 %; Value: 200k; Summary: ="Type"+" "+"Part Number"+" "+"Manufacturer"+" "+"Value"+" "+"Tolerance"+" "+"Operating Temperature"+" "+"Case"+" "+"Power Dissipation"+" "+"Rated Current"+" "+"Rated Power"+" "+"Rated Voltage"+" "+"Other"; Assembly: *; Case: 0603; Part Number: RC0603FR-07200KL
ZQ1 = ECS-80-12-33-JGN-TR: CRYSTAL 8.0000MHZ 12PF SMD; Manufacturer: ECS Inc.; Power Dissipation: * W; Rated Voltage: * V; Rated Current: * A; Tolerance: 20 ppm; Other: 8 MHz ±20ppm Crystal 12pF 400 Ohms 4-SMD, No Lead; Operating Temperature: -40 °C to +85 °C; Type: crystall; HelpURL: https://www.digikey.com/en/products/detail/ecs-inc/ECS-80-12-33-JGN-TR/10478754; Default Comment: 8.0000 MHz; Rated Power: * W; Value: 8.0000 MHz; Summary: ="Type"+" "+"Part Number"+" "+"Manufacturer"+" "+"Value"+" "+"Tolerance"+" "+"Operating Temperature"+" "+"Case"+" "+"Power Dissipation"+" "+"Rated Current"+" "+"Rated Power"+" "+"Rated Voltage"+" "+"Other"; Assembly: *; Case: 3.20mm x 2.50mm; Part Number: ECS-80-12-33-JGN-TR

## Sheet DAC.SchDoc: Digital to analog converter.
size 297 x 209 mm; Author: Dmitry Shpakov; Organization: NoName; Revision: Revision; SheetNumber: 7; SheetTotal: 10; PageSize: A4; ProjectName: Project Name
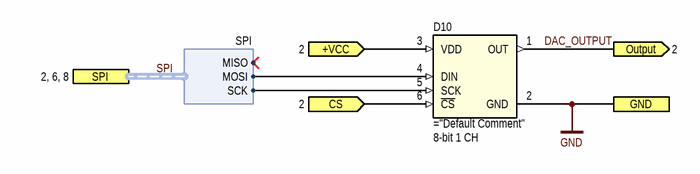
[diagram p6: DAC.SchDoc]

### Parts
D10  value 8-bit 1 CH  (no BOM)

### Ports
+VCC (in, see 2), CS (in, see 2), GND (see 2, 3, 4, 5, 6, 8, 9, 10), Output (out, see 2), SPI (harness SPI, see 2, 6, 8)

### Harnesses
SPI: MISO, MOSI, SCK

### Nets
+3V3: D10.3(VDD) ; port +VCC
GND: D10.2(GND) ; port GND
DAC_CS: D10.6(~{CS}) ; port CS
DAC_OUTPUT: D10.1(OUT) ; port Output
ISP.PDI: D10.4(DIN) ; port SPI.MOSI
ISP.SCK: D10.5(SCK) ; port SPI.SCK

### Buses and harness runs
harness SPI = port SPI

### Notes on the sheet
- Author
- Date
- Organization
- Page
- Total pages
- Materials
- Page size

### Library data of the parts
D10 = MAX5385EZT+T: IC DAC 8BIT V-OUT TSOT23-6; Manufacturer: Analog Devices Inc./Maxim Integrated; Power Dissipation: * W; Rated Voltage: 2.7 V ~ 5.5 V; Rated Current: * A; Tolerance: * %; Other: 8 Bit Digital to Analog Converter 1 TSOT-23-6; Operating Temperature: -40 °C to +125 °C; Type: ic; HelpURL: https://www.digikey.com/en/products/detail/analog-devices-inc-maxim-integrated/MAX5385EZT-T/1781900; Default Comment: MAX5385EZT+T; Rated Power: * W; Summary: ="Type"+" "+"Part Number"+" "+"Manufacturer"+" "+"Value"+" "+"Tolerance"+" "+"Operating Temperature"+" "+"Case"+" "+"Power Dissipation"+" "+"Rated Current"+" "+"Rated Power"+" "+"Rated Voltage"+" "+"Other"; Assembly: *; Case: SOT-23-6; Part Number: MAX5385EZT+T

## Sheet External_connectors.SchDoc: External connectors.
size 297 x 209 mm; Author: Dmitry Shpakov; Organization: NoName; Revision: Revision; SheetNumber: 8; SheetTotal: 10; PageSize: A4; ProjectName: Project Name
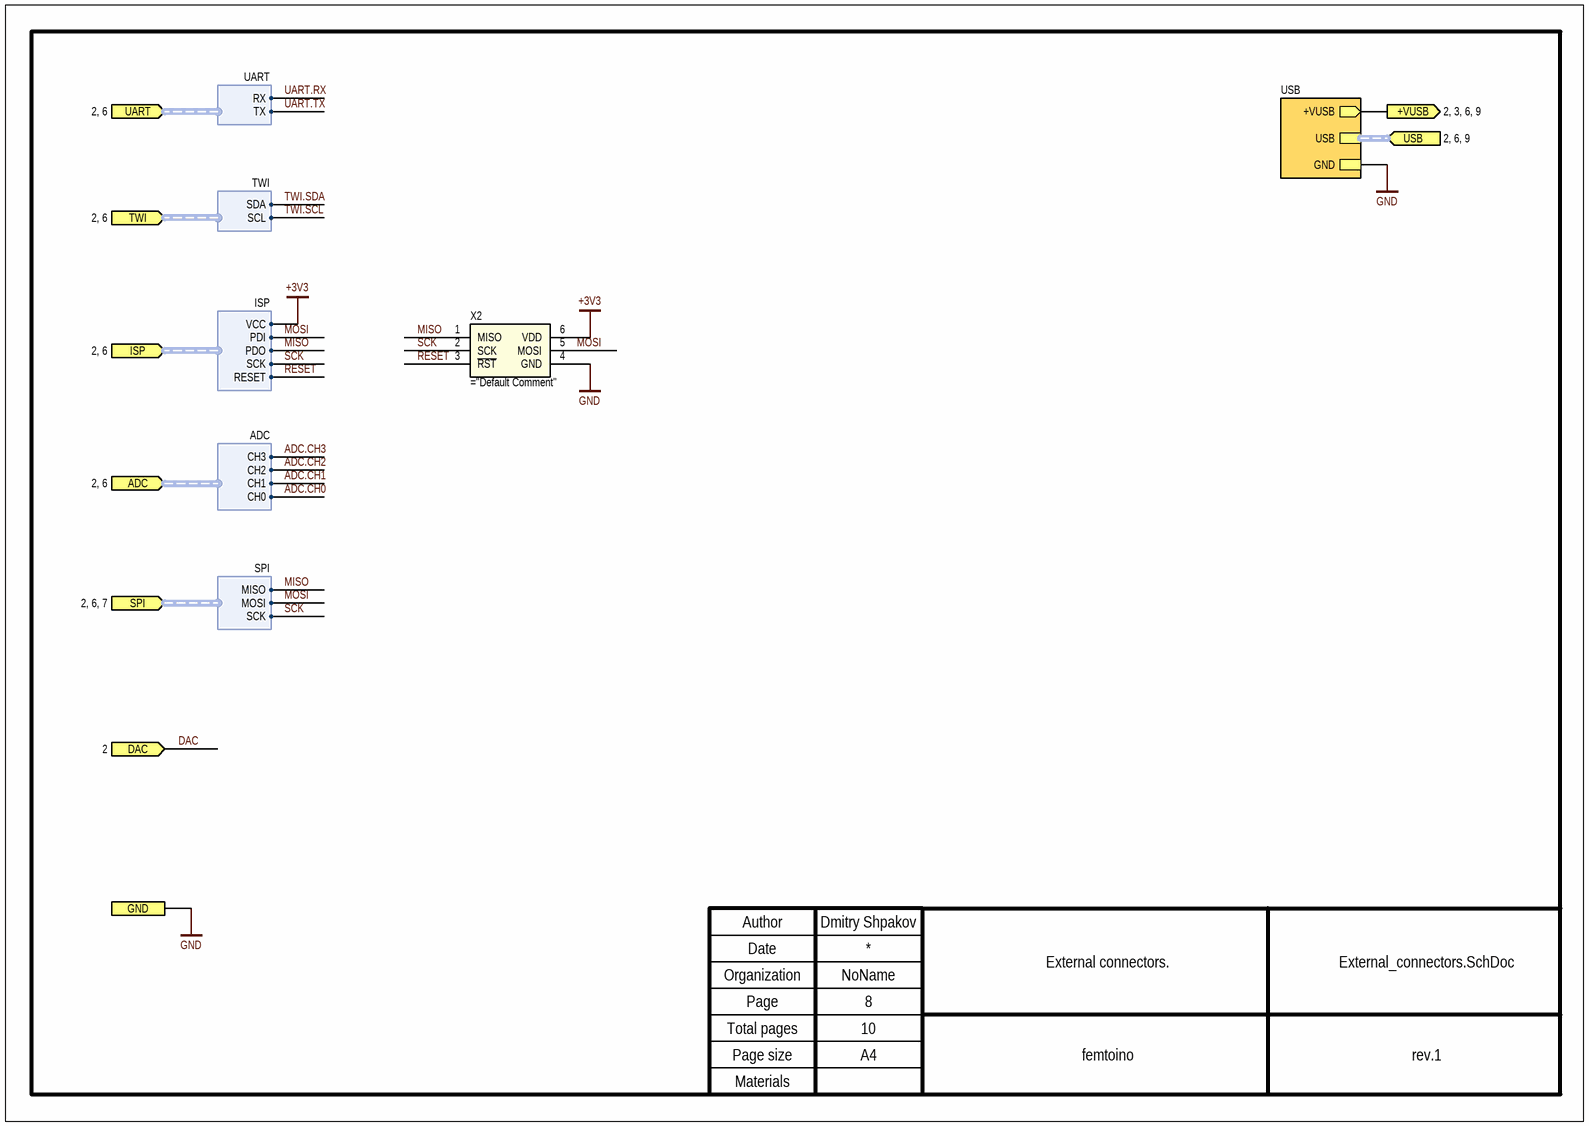
[diagram p7: External_connectors.SchDoc]

### Parts
X2  (no value)  (no BOM)

### Sub-sheets
USB = USB.SchDoc: USB (harness USB), +VUSB (out), GND

### Ports
+VUSB (out, see 2, 3, 6, 9), ADC (in, harness ADC, see 2, 6), DAC (in, see 2), GND (see 2, 3, 4, 5, 6, 7, 9, 10), ISP (in, harness ISP, see 2, 6), SPI (in, harness SPI, see 2, 6, 7), TWI (in, harness TWI, see 2, 6), UART (in, harness UART, see 2, 6), USB (in, see 2, 6, 9)

### Harnesses
UART: RX, TX
TWI: SDA, SCL
ISP: VCC, PDI, PDO, SCK, RESET
ADC: CH3, CH2, CH1, CH0
SPI: MISO, MOSI, SCK

### Nets
+3V3: X2.6(VDD) ; port ISP.VCC
+VUSB: port +VUSB, sheet USB/+VUSB
GND: X2.4(GND) ; port GND, sheet USB/GND
MISO: X2.1(MISO) ; port ISP.PDO, port SPI.MISO  [project net ISP.PDO]
MOSI: X2.5(MOSI) ; port ISP.PDI, port SPI.MOSI  [project net ISP.PDI]
~{RESET}: X2.3(~{RST}) ; port ISP.RESET  [project net ISP.RESET]
SCK: X2.2(SCK) ; port ISP.SCK, port SPI.SCK  [project net ISP.SCK]

### Buses and harness runs
harness port USB = sheet USB/USB

### Notes on the sheet
- Author
- Date
- Organization
- Page
- Total pages
- Materials
- Page size

### Library data of the parts
X2 = ISP: In system programming interface.; Power Dissipation: * W; Rated Voltage: * V; Rated Current: * A; Tolerance: * %; Value: ISP; Operating Temperature: *; Type: connector; HelpURL: *; Default Comment: ISP; Rated Power: * W; Other: *; Summary: ="Type"+" "+"Part Number"+" "+"Manufacturer"+" "+"Value"+" "+"Tolerance"+" "+"Operating Temperature"+" "+"Case"+" "+"Power Dissipation"+" "+"Rated Current"+" "+"Rated Power"+" "+"Rated Voltage"+" "+"Other"; Assembly: *; Case: *; Manufacturer: *; Part Number: *

## Sheet USB.SchDoc: USB-C connector
size 297 x 209 mm; Author: Dmitry Shpakov; Organization: NoName; Revision: Revision; SheetNumber: 11; SheetTotal: 12; PageSize: A4; ProjectName: Project Name
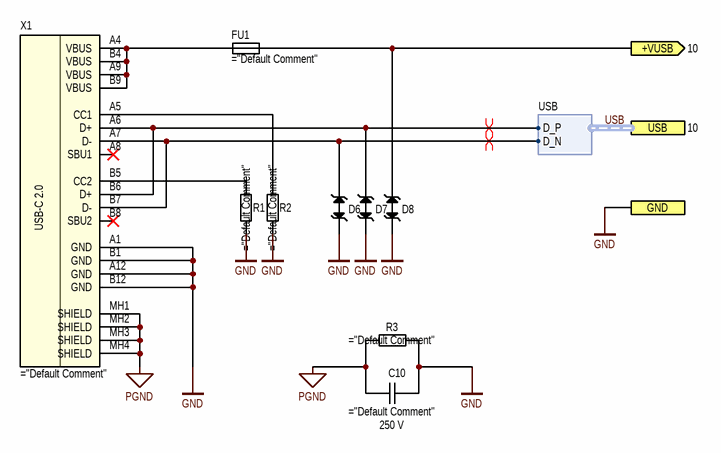
[diagram p8: USB.SchDoc]

### Parts
C10  Rated Voltage: 250 V
D6  (no value)
D7  (no value)
D8  (no value)
FU1  (no value)
R1  (no value)
R2  (no value)
R3  (no value)
X1  (no value)

### Ports
+VUSB (out, see 10), GND (see 10, 3, 4, 5, 6, 9, 10, 12), USB (harness USB, see 10)

### Harnesses
USB: D_P, D_N

### Nets
+VUSB: D8.1 FU1.2 ; port +VUSB
GND: C10.2 D6.2 D7.2 D8.2 R1.2 R2.2 R3.2 X1.A1(GND) X1.A12(GND) X1.B1(GND) X1.B12(GND) ; port GND
PGND: C10.1 R3.1 X1.MH1(SHIELD) X1.MH2(SHIELD) X1.MH3(SHIELD) X1.MH4(SHIELD)
USB.D_N: D6.1 X1.A7(D-) X1.B7(D-) ; port USB.D_N
USB.D_P: D7.1 X1.A6(D+) X1.B6(D+) ; port USB.D_P
NetFU1_1: FU1.1 X1.A4(VBUS) X1.A9(VBUS) X1.B4(VBUS) X1.B9(VBUS)
NetR1_1: R1.1 X1.B5(CC2)
NetR2_1: R2.1 X1.A5(CC1)

Not connected (* = marked no-connect by the designer): X1 A8(SBU1)* B8(SBU2)*

### Buses and harness runs
harness USB = port USB

### Layout directives
differential pair: USB.D_N, USB.D_P

### Notes on the sheet
- Author
- Date
- Organization
- Page
- Total pages
- Materials
- Page size
- (in symbol USB4085-GF-A) USB-C 2.0

### Library data of the parts
C10 = CC0805KRX7RYBB472: CAP CER 4700PF 250V X7R 0805; Manufacturer: YAGEO; Type: capacitor; Power Dissipation: * W; Rated Current: * A; Tolerance: 10 %; Other: 4700 pF ±10% 250V Ceramic Capacitor X7R 0805 (2012 Metric); Operating Temperature: -55 °C to +125 °C; HelpURL: https://www.digikey.com/en/products/detail/yageo/CC0805KRX7RYBB472/5884263; Default Comment: 4700 pF; Rated Power: * W; Value: 4700 pF; Summary: ="Type"+" "+"Part Number"+" "+"Manufacturer"+" "+"Value"+" "+"Tolerance"+" "+"Operating Temperature"+" "+"Case"+" "+"Power Dissipation"+" "+"Rated Current"+" "+"Rated Power"+" "+"Rated Voltage"+" "+"Other"; Assembly: *; Case: 0805; Part Number: CC0805KRX7RYBB472
D6-D8 = UAD8C05L01: TVS DIODE 5VWM 20VC SOD882; Manufacturer: YAGEO; Power Dissipation: * W; Rated Voltage: 20 V; Rated Current: * A; Tolerance: * %; Other: 20V (Typ) Clamp 3A (8/20µs) Ipp Tvs Diode Surface Mount SOD-882; Operating Temperature: -50 °C to +150 °C; Type: diode; HelpURL: https://www.digikey.com/en/products/detail/yageo/UAD8C05L01/13689529; Default Comment: UAD8C05L01; Rated Power: * W; Value: *; Summary: ="Type"+" "+"Part Number"+" "+"Manufacturer"+" "+"Value"+" "+"Tolerance"+" "+"Operating Temperature"+" "+"Case"+" "+"Power Dissipation"+" "+"Rated Current"+" "+"Rated Power"+" "+"Rated Voltage"+" "+"Other"; Assembly: *; Case: SOD-882; Part Number: UAD8C05L01
FU1 = 04000025WR: FUSE 500MA 5V FAST 0603 SMD; Manufacturer: Littelfuse Inc.; Power Dissipation: * W; Tolerance: * %; Other: 500 mA AC 5 V DC Fuse Board Mount (Cartridge Style Excluded) Surface Mount 0603 (1608 Metric); Operating Temperature: -55 °C to +150 °C; Type: fuse; HelpURL: https://www.digikey.com/en/products/detail/littelfuse-inc/04000025WR/10271162?s=N4IgjCBcoGwJxVAYygMwIYBsDOBTANCAPZQDaIALAAxwDMdIAuoQA4AuUIAymwE4CWAOwDmIAL6EATFQAcMxCBSQMOAsTIgArFSoACALYBBJqw6QQAVUH82AeVQBZXOmwBXXrnFSwFCgqUqeIQkkOSaugBqJiDsnFY29k4u7p4SIAC0kv5QfK5qIWFMYmlZoSCornhFQA; Default Comment: 500 mA; Rated Voltage: 5 V; Rated Current: 500 mA; Rated Power: * W; Value: *; Summary: ="Type"+" "+"Part Number"+" "+"Manufacturer"+" "+"Value"+" "+"Tolerance"+" "+"Operating Temperature"+" "+"Case"+" "+"Power Dissipation"+" "+"Rated Current"+" "+"Rated Power"+" "+"Rated Voltage"+" "+"Other"; Assembly: *; Case: 0603; Part Number: 04000025WR
R1 R2 = RC0603FR-075K1L: as R14 on sheet MCU; Operating Temperature: -55 °C to +155 °C; Type: resistor; HelpURL: https://www.digikey.com/en/products/detail/yageo/RC0603FR-075K1L/727268; Power Dissipation: 1/10 W; Rated Power: 1/10 W; Tolerance: 1 %; Summary: ="Type"+" "+"Part Number"+" "+"Manufacturer"+" "+"Value"+" "+"Tolerance"+" "+"Operating Temperature"+" "+"Case"+" "+"Power Dissipation"+" "+"Rated Current"+" "+"Rated Power"+" "+"Rated Voltage"+" "+"Other"; Assembly: *; Case: 0603; Part Number: RC0603FR-075K1L
R3 = RC0603FR-071ML: as R7 on sheet Li-ion_charger; Operating Temperature: -55 °C to +155 °C; Type: resistor; HelpURL: https://www.digikey.com/en/products/detail/yageo/RC0603FR-071ML/726844; Default Comment: 1M; Rated Power: 0.1 W; Tolerance: 1 %; Value: 1M; Summary: ="Type"+" "+"Part Number"+" "+"Manufacturer"+" "+"Value"+" "+"Tolerance"+" "+"Operating Temperature"+" "+"Case"+" "+"Power Dissipation"+" "+"Rated Current"+" "+"Rated Power"+" "+"Rated Voltage"+" "+"Other"; Assembly: *; Case: 0603; Part Number: RC0603FR-071ML
X1 = USB4085-GF-A: CONN RCPT USB2.0 TYPE C 16+8POS; Manufacturer: GCT; Power Dissipation: * W; Rated Voltage: * V; Rated Current: * A; Tolerance: * %; Other: USB-C (USB TYPE-C) USB 2.0 Receptacle Connector 24 (16+8 Dummy) Position Through Hole, Right Angle; Operating Temperature: -40 °C to +85 °C; Type: connector; HelpURL: https://www.digikey.com/en/products/detail/gct/USB4085-GF-A/9859662; Default Comment: USB4085-GF-A; Rated Power: * W; Value: *; Summary: ="Type"+" "+"Part Number"+" "+"Manufacturer"+" "+"Value"+" "+"Tolerance"+" "+"Operating Temperature"+" "+"Case"+" "+"Power Dissipation"+" "+"Rated Current"+" "+"Rated Power"+" "+"Rated Voltage"+" "+"Other"; Assembly: *; Case: USB-C (USB TYPE-C) Through Hole, Right Angle; Part Number: USB4085-GF-A

## Sheet LED.SchDoc: RGB LED.
size 297 x 209 mm; Author: Dmitry Shpakov; Organization: NoName; Revision: Revision; SheetNumber: 8; SheetTotal: 10; PageSize: A4; ProjectName: Project Name
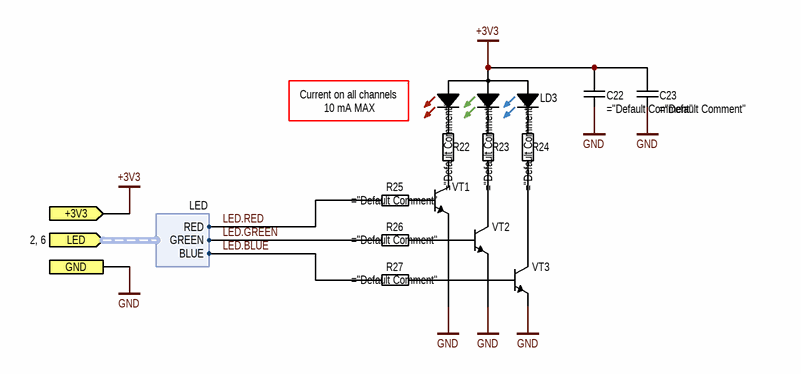
[diagram p9: LED.SchDoc]

### Parts
C22  (no value)
C23  (no value)
LD3  (no value)
R22  (no value)
R23  (no value)
R24  (no value)
R25  (no value)
R26  (no value)
R27  (no value)
VT1  (no value)
VT2  (no value)
VT3  (no value)

### Ports
+3V3 (in, see 2, 3, 6), GND (see 2, 3, 4, 5, 6, 7, 9, 10), LED (in, harness LED, see 2, 6)

### Harnesses
LED: RED, GREEN, BLUE

### Nets
+3V3: C22.2 C23.2 LD3.CA ; port +3V3
GND: C22.1 C23.1 VT1.E VT2.E VT3.E ; port GND
LED.BLUE: R27.1 ; port LED.BLUE
LED.GREEN: R26.1 ; port LED.GREEN
LED.RED: R25.1 ; port LED.RED
NetLD3_BC: LD3.BC R24.2
NetLD3_GC: LD3.GC R23.2
NetLD3_RC: LD3.RC R22.2
NetR22_1: R22.1 VT1.C
NetR23_1: R23.1 VT2.C
NetR24_1: R24.1 VT3.C
NetR25_2: R25.2 VT1.B
NetR26_2: R26.2 VT2.B
NetR27_2: R27.2 VT3.B

### Notes on the sheet
- Current on all channels
  10 mA MAX
- Author
- Date
- Organization
- Page
- Total pages
- Materials
- Page size

### Library data of the parts
C22 = CC0805KPX5R6BB106: as C2 on sheet Buck_boost_converter; Operating Temperature: -55 °C to +85 °C; HelpURL: https://www.digikey.com/en/products/detail/yageo/CC0805KPX5R6BB106/11611309; Default Comment: 10 uF; Rated Voltage: 10 V; Rated Power: * W; Value: 10 uF; Summary: ="Type"+" "+"Part Number"+" "+"Manufacturer"+" "+"Value"+" "+"Tolerance"+" "+"Operating Temperature"+" "+"Case"+" "+"Power Dissipation"+" "+"Rated Current"+" "+"Rated Power"+" "+"Rated Voltage"+" "+"Other"; Assembly: *; Case: 0805; Part Number: CC0805KPX5R6BB106
C23 = CC0805KKX5R6BB105: as C1 on sheet Buck_boost_converter; Operating Temperature: -55 °C to +85 °C; HelpURL: https://www.digikey.com/en/products/detail/yageo/CC0805KKX5R6BB105/2345239; Default Comment: 1 uF; Rated Voltage: 10 V; Rated Power: * W; Value: 1 uF; Summary: ="Type"+" "+"Part Number"+" "+"Manufacturer"+" "+"Value"+" "+"Tolerance"+" "+"Operating Temperature"+" "+"Case"+" "+"Power Dissipation"+" "+"Rated Current"+" "+"Rated Power"+" "+"Rated Voltage"+" "+"Other"; Assembly: *; Case: 0805; Part Number: CC0805KKX5R6BB105
LD3 = 150066M153000: LED RGB DIFFUSED SMD; Manufacturer: Würth Elektronik; Power Dissipation: * W; Tolerance: * %; Other: Red, Green, Blue (RGB) 624nm Red, 525nm Green, 470nm Blue LED Indication - Discrete 2V Red, 3.3V Green, 3.3V Blue 0606 (1616 Metric); Rated Voltage: 2V Red; 3.3V Green; 3.3V Blue; Rated Current: 20 mA; Value: Red; Green; Blue; Operating Temperature: -40 °C to +85 °C; Type: led; HelpURL: https://www.digikey.com/en/products/detail/w%C3%BCrth-elektronik/150066M153000/7315709; Default Comment: 150066M153000; Rated Power: * W; Summary: ="Type"+" "+"Part Number"+" "+"Manufacturer"+" "+"Value"+" "+"Tolerance"+" "+"Operating Temperature"+" "+"Case"+" "+"Power Dissipation"+" "+"Rated Current"+" "+"Rated Power"+" "+"Rated Voltage"+" "+"Other"; Assembly: *; Case: 0606; Part Number: 150066M153000
R22 R23 = RC0603FR-0710RL: RES 10 OHM 1% 1/10W 0603; Manufacturer: YAGEO; Default Comment: 10R; Power Dissipation: 0.1 W; Rated Voltage: * V; Rated Current: * A; Value: 10R; Other: 10 Ohms ±1% 0.1W, 1/10W Chip Resistor 0603 (1608 Metric) Moisture Resistant Thick Film; Operating Temperature: -55 °C to +155 °C; Type: resistor; HelpURL: https://www.digikey.com/en/products/detail/yageo/RC0603FR-0710RL/726879; Rated Power: 0.1 W; Tolerance: 1 %; Summary: ="Type"+" "+"Part Number"+" "+"Manufacturer"+" "+"Value"+" "+"Tolerance"+" "+"Operating Temperature"+" "+"Case"+" "+"Power Dissipation"+" "+"Rated Current"+" "+"Rated Power"+" "+"Rated Voltage"+" "+"Other"; Assembly: *; Case: 0603; Part Number: RC0603FR-0710RL
R24 = RC0603FR-07133RL: RES 133 OHM 1% 1/10W 0603; Manufacturer: YAGEO; Default Comment: 133R; Power Dissipation: 0.1 W; Rated Voltage: * V; Rated Current: * A; Value: 133R; Other: 133 Ohms ±1% 0.1W, 1/10W Chip Resistor 0603 (1608 Metric) Moisture Resistant Thick Film; Operating Temperature: -55 °C to +155 °C; Type: resistor; HelpURL: https://www.digikey.com/en/products/detail/yageo/RC0603FR-07133RL/726936; Rated Power: 0.1 W; Tolerance: 1 %; Summary: ="Type"+" "+"Part Number"+" "+"Manufacturer"+" "+"Value"+" "+"Tolerance"+" "+"Operating Temperature"+" "+"Case"+" "+"Power Dissipation"+" "+"Rated Current"+" "+"Rated Power"+" "+"Rated Voltage"+" "+"Other"; Assembly: *; Case: 0603; Part Number: RC0603FR-07133RL
R25-R27 = RC0603FR-071KL: RES 1K OHM 1% 1/10W 0603; Manufacturer: YAGEO; Rated Voltage: * V; Rated Current: * A; Other: 1 kOhms ±1% 0.1W, 1/10W Chip Resistor 0603 (1608 Metric) Moisture Resistant Thick Film; Operating Temperature: -55 °C to +155 °C; Type: resistor; HelpURL: https://www.digikey.com/en/products/detail/yageo/RC0603FR-071KL/726843; Default Comment: 1k; Power Dissipation: 1/10 W; Rated Power: 1/10 W; Tolerance: 1 %; Value: 1k; Summary: ="Type"+" "+"Part Number"+" "+"Manufacturer"+" "+"Value"+" "+"Tolerance"+" "+"Operating Temperature"+" "+"Case"+" "+"Power Dissipation"+" "+"Rated Current"+" "+"Rated Power"+" "+"Rated Voltage"+" "+"Other"; Assembly: *; Case: 0603; Part Number: RC0603FR-071KL
VT1-VT3 = MMBT2222A-TP: TRANS NPN 40V 0.6A SOT23; Manufacturer: Micro Commercial Co; Type: transistor; Power Dissipation: 350 mW; Rated Voltage: * V; Rated Current: 600 mA; Tolerance: * %; Other: Bipolar (BJT) Transistor NPN 40 V 600 mA 300MHz 350 mW Surface Mount SOT-23; Operating Temperature: -55 °C to +150 °C; HelpURL: https://www.digikey.com/en/products/detail/micro-commercial-co/MMBT2222A-TP/717279; Default Comment: MMBT2222A-TP; Rated Power: 350 mW; Value: npn; Summary: ="Type"+" "+"Part Number"+" "+"Manufacturer"+" "+"Value"+" "+"Tolerance"+" "+"Operating Temperature"+" "+"Case"+" "+"Power Dissipation"+" "+"Rated Current"+" "+"Rated Power"+" "+"Rated Voltage"+" "+"Other"; Assembly: *; Case: SOT-23; Part Number: MMBT2222A-TP

## Sheet Buzzer.SchDoc: Buzzer.
size 297 x 209 mm; Author: Dmitry Shpakov; Organization: NoName; Revision: Revision; SheetNumber: 9; SheetTotal: 11; PageSize: A4; ProjectName: Project Name
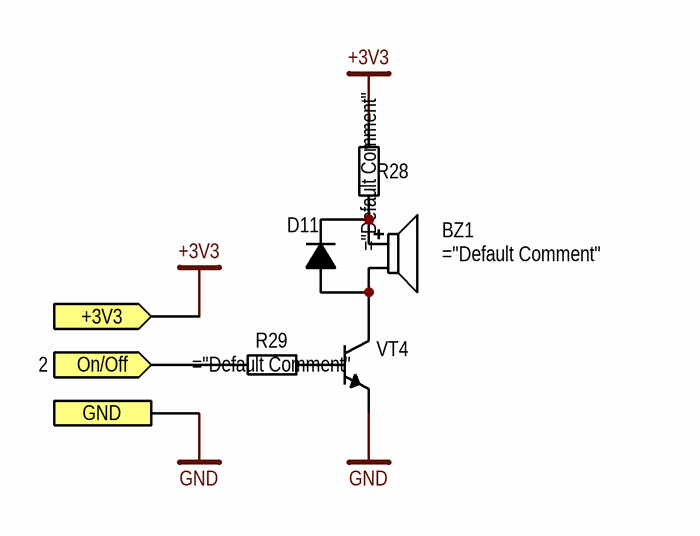
[diagram p10: Buzzer.SchDoc]

### Parts
BZ1  (no value)
D11  (no value)
R28  (no value)
R29  (no value)
VT4  (no value)

### Ports
+3V3 (in, see 2, 3, 6, 8), GND (see 2, 3, 4, 5, 6, 7, 8, 10, 11), On/Off (in, see 2)

### Nets
+3V3: R28.2 ; port +3V3
GND: VT4.E ; port GND
BUZZER: R29.1 ; port On/Off
NetBZ1_NEG: BZ1.NEG D11.A VT4.C
NetBZ1_POS: BZ1.POS D11.C R28.1
NetR29_2: R29.2 VT4.B

### Notes on the sheet
- Author
- Date
- Organization
- Page
- Total pages
- Materials
- Page size

### Library data of the parts
BZ1 = SMT-0540-S-R: BUZZER MAGNETIC 3V 5X5MM SMD; Manufacturer: PUI Audio, Inc.; Power Dissipation: * W; Rated Current: 100 mA; Tolerance: * %; Other: Buzzers Transducer, Externally Driven Electromechanical/Magnetic 3 V 100mA 4kHz 78dB @ 3V, 10cm Surface Mount Solder Pads; Operating Temperature: -30 °C to +70 °C; Type: buzzer; HelpURL: https://www.digikey.com/en/products/detail/pui-audio-inc/SMT-0540-S-R/1464799; Default Comment: SMT-0540-S-R; Rated Voltage: 3 V; Rated Power: * W; Value: *; Summary: ="Type"+" "+"Part Number"+" "+"Manufacturer"+" "+"Value"+" "+"Tolerance"+" "+"Operating Temperature"+" "+"Case"+" "+"Power Dissipation"+" "+"Rated Current"+" "+"Rated Power"+" "+"Rated Voltage"+" "+"Other"; Assembly: *; Case: 5.0mm x 5.0mm; Part Number: SMT-0540-S-R
D11 = 1N4148WX-TP: DIODE GEN PURP 75V 150MA SOD323; Manufacturer: Micro Commercial Co; Power Dissipation: * W; Rated Current: 150 A; Tolerance: * %; Other: Diode 75 V 150mA Surface Mount SOD-323; Operating Temperature: -55 °C to +150 °C; Type: diode; HelpURL: https://www.digikey.com/en/products/detail/micro-commercial-co/1N4148WX-TP/717197; Default Comment: 1N4148WX-TP; Rated Voltage: 75 V; Rated Power: * W; Value: *; Summary: ="Type"+" "+"Part Number"+" "+"Manufacturer"+" "+"Value"+" "+"Tolerance"+" "+"Operating Temperature"+" "+"Case"+" "+"Power Dissipation"+" "+"Rated Current"+" "+"Rated Power"+" "+"Rated Voltage"+" "+"Other"; Assembly: *; Case: SOD-323; Part Number: 1N4148WX-TP
R28 = RC0603FR-0722RL: as R11 on sheet MCU; Operating Temperature: -55 °C to +155 °C; Type: resistor; HelpURL: https://www.digikey.com/en/products/detail/yageo/RC0603FR-0722RL/727055; Power Dissipation: 1/10 W; Rated Power: 1/10 W; Tolerance: 1 %; Summary: ="Type"+" "+"Part Number"+" "+"Manufacturer"+" "+"Value"+" "+"Tolerance"+" "+"Operating Temperature"+" "+"Case"+" "+"Power Dissipation"+" "+"Rated Current"+" "+"Rated Power"+" "+"Rated Voltage"+" "+"Other"; Assembly: *; Case: 0603; Part Number: RC0603FR-0722RL
R29 = RC0603FR-071KL: as R25 on sheet LED; Operating Temperature: -55 °C to +155 °C; Type: resistor; HelpURL: https://www.digikey.com/en/products/detail/yageo/RC0603FR-071KL/726843; Default Comment: 1k; Power Dissipation: 1/10 W; Rated Power: 1/10 W; Tolerance: 1 %; Value: 1k; Summary: ="Type"+" "+"Part Number"+" "+"Manufacturer"+" "+"Value"+" "+"Tolerance"+" "+"Operating Temperature"+" "+"Case"+" "+"Power Dissipation"+" "+"Rated Current"+" "+"Rated Power"+" "+"Rated Voltage"+" "+"Other"; Assembly: *; Case: 0603; Part Number: RC0603FR-071KL
VT4 = MMBT2222A-TP: as VT1 on sheet LED; Operating Temperature: -55 °C to +150 °C; HelpURL: https://www.digikey.com/en/products/detail/micro-commercial-co/MMBT2222A-TP/717279; Default Comment: MMBT2222A-TP; Rated Power: 350 mW; Value: npn; Summary: ="Type"+" "+"Part Number"+" "+"Manufacturer"+" "+"Value"+" "+"Tolerance"+" "+"Operating Temperature"+" "+"Case"+" "+"Power Dissipation"+" "+"Rated Current"+" "+"Rated Power"+" "+"Rated Voltage"+" "+"Other"; Assembly: *; Case: SOT-23; Part Number: MMBT2222A-TP